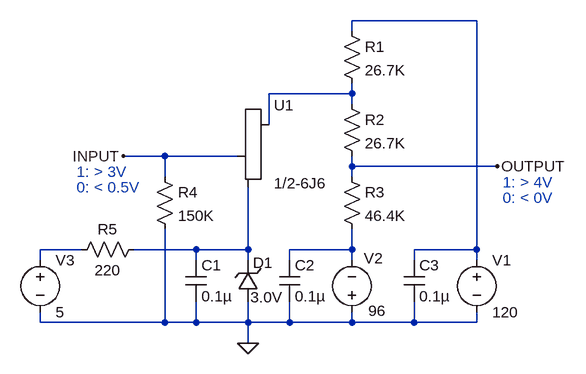
[diagram p0: schematic single-ltspice.asc]
single-ltspice.asc, the LTspice schematic file:
Version 4
SHEET 1 880 680
WIRE 448 96 256 96
WIRE 256 112 256 96
WIRE 256 208 256 192
WIRE 256 208 128 208
WIRE 256 224 256 208
WIRE 128 256 128 208
WIRE -32 304 -96 304
WIRE 80 304 -32 304
WIRE 256 320 256 304
WIRE 480 320 256 320
WIRE -32 336 -32 304
WIRE 256 336 256 320
WIRE -160 448 -224 448
WIRE 16 448 -80 448
WIRE 96 448 96 352
WIRE 96 448 16 448
WIRE 256 448 256 416
WIRE 256 448 160 448
WIRE 448 448 448 96
WIRE 448 448 352 448
WIRE -224 464 -224 448
WIRE 16 464 16 448
WIRE 96 464 96 448
WIRE 160 464 160 448
WIRE 256 464 256 448
WIRE 352 464 352 448
WIRE 448 464 448 448
WIRE -224 560 -224 544
WIRE -32 560 -32 416
WIRE -32 560 -224 560
WIRE 16 560 16 528
WIRE 16 560 -32 560
WIRE 96 560 96 528
WIRE 96 560 16 560
WIRE 160 560 160 528
WIRE 160 560 96 560
WIRE 256 560 256 544
WIRE 256 560 160 560
WIRE 352 560 352 528
WIRE 352 560 256 560
WIRE 448 560 448 544
WIRE 448 560 352 560
WIRE 96 592 96 560
FLAG 96 592 0
FLAG 480 320 OUTPUT
FLAG -96 304 INPUT
SYMBOL res 240 96 R0
SYMATTR InstName R1
SYMATTR Value 26.7K
SYMBOL res 240 208 R0
SYMATTR InstName R2
SYMATTR Value 26.7K
SYMBOL res 240 320 R0
SYMATTR InstName R3
SYMATTR Value 46.4K
SYMBOL res -48 320 R0
SYMATTR InstName R4
SYMATTR Value 150K
SYMBOL zener 112 528 R180
WINDOW 0 -22 60 Left 2
WINDOW 3 -37 7 Left 2
SYMATTR InstName D1
SYMATTR Value 3.0V
SYMBOL Misc\\triode 128 304 R0
SYMATTR InstName U1
SYMATTR Value 1/2-6J6
SYMBOL res -64 432 R90
WINDOW 0 0 56 VBottom 2
WINDOW 3 32 56 VTop 2
SYMATTR InstName R5
SYMATTR Value 220
SYMBOL voltage 448 448 R0
SYMATTR InstName V1
SYMATTR Value 120
SYMBOL voltage 256 560 R180
WINDOW 0 -48 99 Left 2
WINDOW 3 -52 18 Left 2
SYMATTR InstName V2
SYMATTR Value 96
SYMBOL voltage -224 448 R0
SYMATTR InstName V3
SYMATTR Value 5
SYMBOL cap 0 464 R0
SYMATTR InstName C1
SYMATTR Value 0.1µ
SYMBOL cap 144 464 R0
SYMATTR InstName C2
SYMATTR Value 0.1µ
SYMBOL cap 336 464 R0
SYMATTR InstName C3
SYMATTR Value 0.1µ
TEXT 488 344 Left 2 ;1: > 4V
TEXT 488 368 Left 2 ;0: < 0V
TEXT -168 328 Left 2 ;1: > 3V
TEXT -168 352 Left 2 ;0: < 0.5V

The netlist it stands for:
* single-ltspice.asc
R1 N001 N002 26.7K
R2 N002 OUTPUT 26.7K
R3 OUTPUT N005 46.4K
R4 INPUT 0 150K
D1 0 N004 3.0V
XU1 N002 INPUT N004 1/2-6J6
R5 N004 N003 220
V1 N001 0 120
V2 0 N005 96
V3 N003 0 5
C1 N004 0 0.1µ
C2 N005 0 0.1µ
C3 N001 0 0.1µ
.model D D
.lib standard.dio
* 1: > 4V
* 0: < 0V
* 1: > 3V
* 0: < 0.5V
.backanno
.end